# EAGLE design w65c265sxb_tms9118_dram (EAGLE 9.6.2)
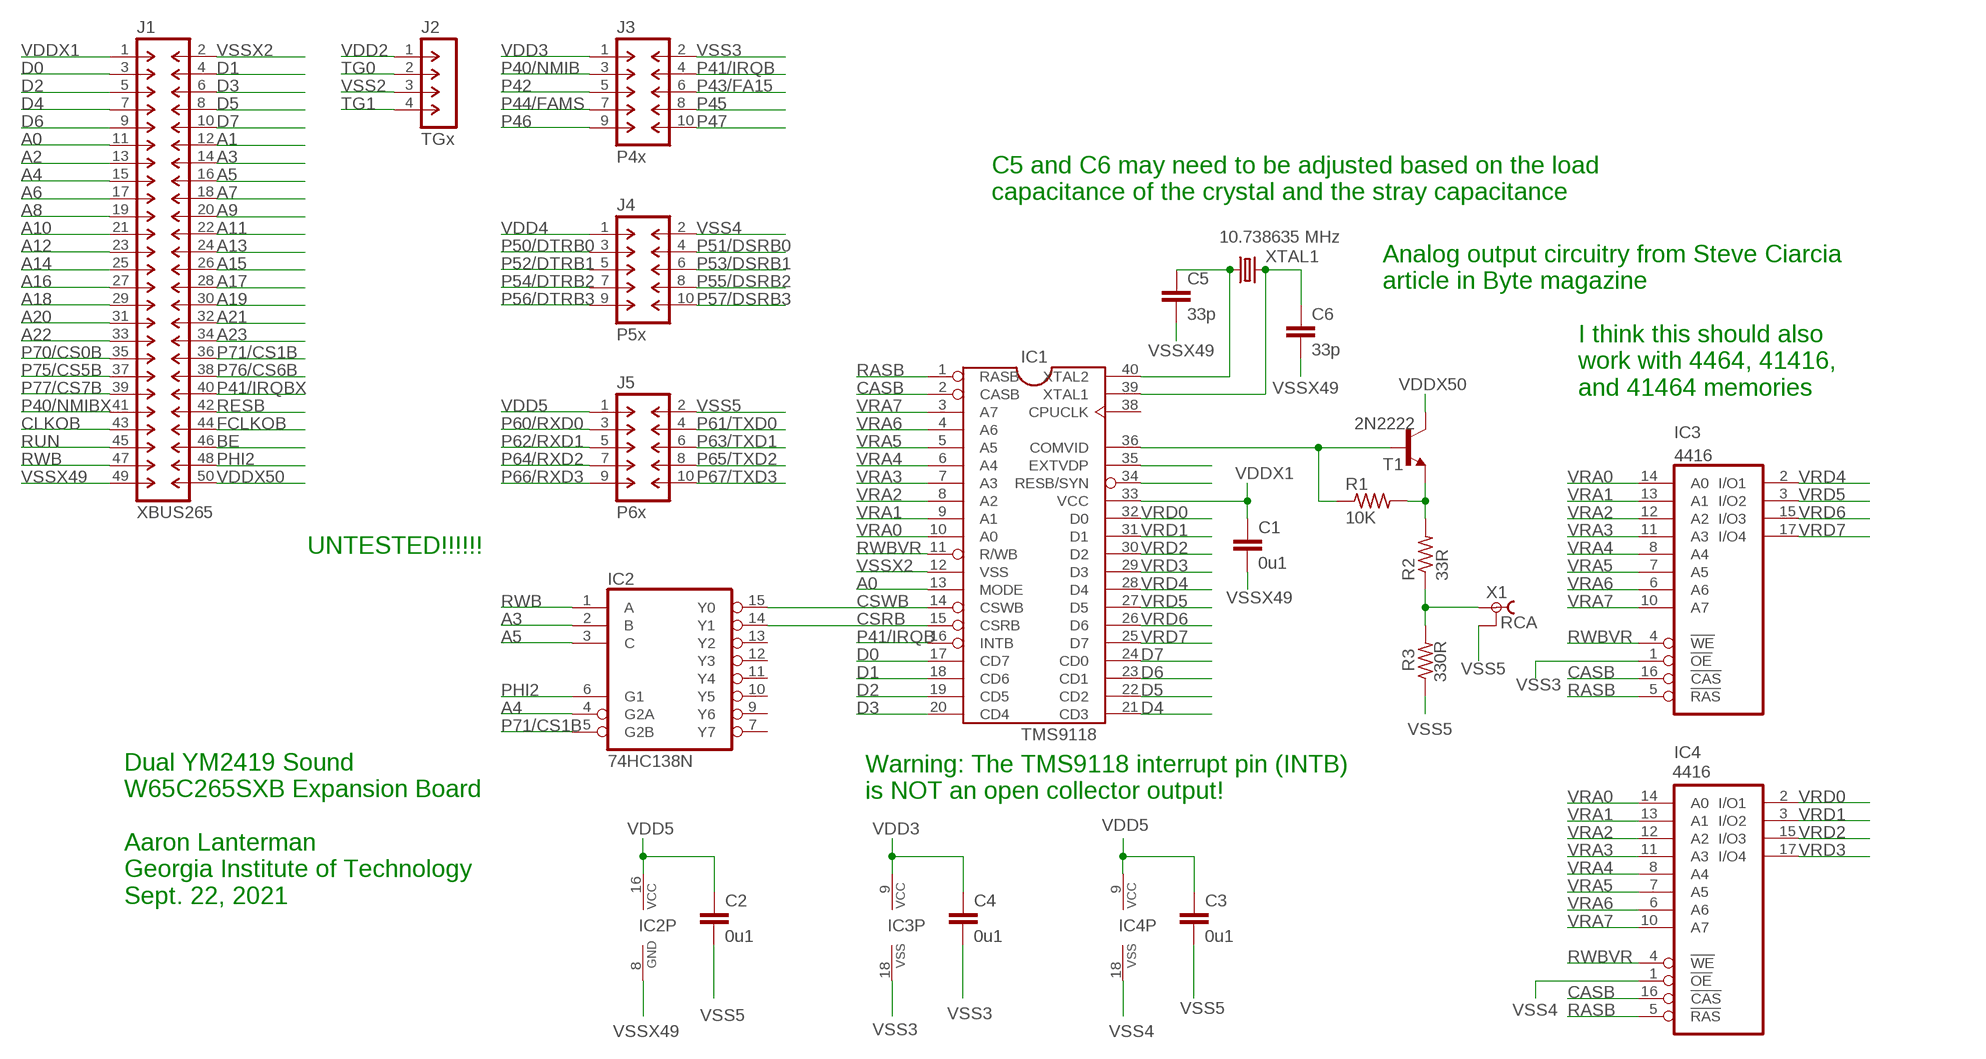
[diagram p0: schematic, sheet 1]

## Parts
C1  0u1  C-EU050-025X075-AARON  [C050-025X075-AARON]
C2  0u1  C-EU050-025X075-AARON  [C050-025X075-AARON]
C3  0u1  C-EU050-025X075-AARON  [C050-025X075-AARON]
C4  0u1  C-EU050-025X075-AARON  [C050-025X075-AARON]
C5  33p  C-EU050-025X075-AARON  [C050-025X075-AARON]
C6  33p  C-EU050-025X075-AARON  [C050-025X075-AARON]
IC1  TMS9118  [DIL40]
IC2  74HC138N  [DIL16]
IC3  41464  [DIL18]
IC4  41464  [DIL18]
J1  XBUS265  M-2X25-DIL-100  [DIL-100-2X25]
J2  TGx  M-1X04-SIP-100-40  [SIP-100-04-40]
J3  P4x  M-2X05-DIL-100  [DIL-100-2X05]
J4  P5x  M-2X05-DIL-100  [DIL-100-2X05]
J5  P6x  M-2X05-DIL-100  [DIL-100-2X05]
R1  10K  R-US_0207/10  [0207/10]
R2  33R  R-US_0207/10  [0207/10]
R3  330R  R-US_0207/10  [0207/10]
T1  2N2222  [TO92-EBC-OVAL]
X1  RCA  TOBU3  [TOBU3]
XTAL1  10.738635 MHz  CRYSTALHC49S  [HC49/S]

## Nets
A0: IC1.13(MODE) J1.11
A1: J1.12
A2: J1.13
A3: IC2.2(B) J1.14
A4: IC2.4(G2A) J1.15
A5: IC2.3(C) J1.16
A6: J1.17
A7: J1.18
A8: J1.19
A9: J1.20
A10: J1.21
A11: J1.22
A12: J1.23
A13: J1.24
A14: J1.25
A15: J1.26
A16: J1.27
A17: J1.28
A18: J1.29
A19: J1.30
A20: J1.31
A21: J1.32
A22: J1.33
A23: J1.34
BE: J1.46
CASB: IC1.2(CASB) IC3.16(!CAS) IC4.16(!CAS)
CLKOB: J1.43
CSRB: IC1.15(CSRB) IC2.14(Y1)
CSWB: IC1.14(CSWB) IC2.15(Y0)
D0: IC1.17(CD7) J1.3
D1: IC1.18(CD6) J1.4
D2: IC1.19(CD5) J1.5
D3: IC1.20(CD4) J1.6
D4: IC1.21(CD3) J1.7
D5: IC1.22(CD2) J1.8
D6: IC1.23(CD1) J1.9
D7: IC1.24(CD0) J1.10
FCLKOB: J1.44
N$7: R1.2 R2.2 T1.E
N$8: R2.1 R3.2 X1.1
N$20: IC1.36(COMVID) R1.1 T1.B
N$21: IC1.35(EXTVDP)
N$22: IC1.34(RESB/SYN)
P40/NMIB: J3.3
P40/NMIBX: J1.41
P41/IRQB: IC1.16(INTB) J3.4
P41/IRQBX: J1.40
P42: J3.5
P43/FA15: J3.6
P44/FAMS: J3.7
P45: J3.8
P46: J3.9
P47: J3.10
P50/DTRB0: J4.3
P51/DSRB0: J4.4
P52/DTRB1: J4.5
P53/DSRB1: J4.6
P54/DTRB2: J4.7
P55/DSRB2: J4.8
P56/DTRB3: J4.9
P57/DSRB3: J4.10
P60/RXD0: J5.3
P61/TXD0: J5.4
P62/RXD1: J5.5
P63/TXD1: J5.6
P64/RXD2: J5.7
P65/TXD2: J5.8
P66/RXD3: J5.9
P67/TXD3: J5.10
P70/CS0B: J1.35
P71/CS1B: IC2.5(G2B) J1.36
P75/CS5B: J1.37
P76/CS6B: J1.38
P77/CS7B: J1.39
PHI2: IC2.6(G1) J1.48
RASB: IC1.1(RASB) IC3.5(!RAS) IC4.5(!RAS)
RESB: J1.42
RUN: J1.45
RWB: IC2.1(A) J1.47
RWBVR: IC1.11(R/WB) IC3.4(!WE) IC4.4(!WE)
TG0: J2.2
TG1: J2.4
VDD2: J2.1
VDD3: C4.1 IC3.9(VCC) J3.1
VDD4: J4.1
VDD5: C2.1 C3.1 IC2.16(VCC) IC4.9(VCC) J5.1
VDDX1: C1.1 IC1.33(VCC) J1.1
VDDX50: J1.50 T1.C
VRA0: IC1.10(A0) IC3.14(A0) IC4.14(A0)
VRA1: IC1.9(A1) IC3.13(A1) IC4.13(A1)
VRA2: IC1.8(A2) IC3.12(A2) IC4.12(A2)
VRA3: IC1.7(A3) IC3.11(A3) IC4.11(A3)
VRA4: IC1.6(A4) IC3.8(A4) IC4.8(A4)
VRA5: IC1.5(A5) IC3.7(A5) IC4.7(A5)
VRA6: IC1.4(A6) IC3.6(A6) IC4.6(A6)
VRA7: IC1.3(A7) IC3.10(A7) IC4.10(A7)
VRD0: IC1.32(D0) IC4.2(I/O1)
VRD1: IC1.31(D1) IC4.3(I/O2)
VRD2: IC1.30(D2) IC4.15(I/O3)
VRD3: IC1.29(D3) IC4.17(I/O4)
VRD4: IC1.28(D4) IC3.2(I/O1)
VRD5: IC1.27(D5) IC3.3(I/O2)
VRD6: IC1.26(D6) IC3.15(I/O3)
VRD7: IC1.25(D7) IC3.17(I/O4)
VSS2: J2.3
VSS3: C4.2 IC3.1(!OE) IC3.18(VSS) J3.2
VSS4: IC4.1(!OE) IC4.18(VSS) J4.2
VSS5: C2.2 C3.2 J5.2 R3.1 X1.2 X1.2@1 X1.2@2
VSSX2: IC1.12(VSS) J1.2
VSSX49: C1.2 C5.2 C6.2 IC2.8(GND) J1.49
XTAL1: C6.1 IC1.39(XTAL1) XTAL1.2
XTAL2: C5.1 IC1.40(XTAL2) XTAL1.1
Unconnected: IC1.38(CPUCLK) IC2.7(Y7) IC2.9(Y6) IC2.10(Y5) IC2.11(Y4) IC2.12(Y3) IC2.13(Y2)

## Notes on the sheet
- C5 and C6 may need to be adjusted based on the load
  capacitance of the crystal and the stray capacitance
- Analog output circuitry from Steve Ciarcia
  article in Byte magazine
- I think this should also
  work with 4464, 41416,
  and 41464 memories
- 4416
- UNTESTED!!!!!!
- 4416
- Warning: The TMS9118 interrupt pin (INTB)
  is NOT an open collector output!
- Dual YM2419 Sound
  W65C265SXB Expansion Board
  
  Aaron Lanterman
  Georgia Institute of Technology
  Sept. 22, 2021

## Library data of the parts
C1-C6 = aaroncaps:C-EU: CAPACITOR, European symbol
IC1 = 1987computer:TMS9118: Video Display Controller
IC2 = 74xx-eu:74*138: 3-line to 8-line DECODER/DEMULTIPLEXER
IC3 IC4 = memories:41464: DRAM 64K x 4 bits
J1 = con-headers-jp:M-2X25-: MALE HEADER
J2 = con-headers-jp:M-1X04-: MALE HEADER
J3-J5 = con-headers-jp:M-2X05-: MALE HEADER
R1-R3 = rcl:R-US_: RESISTOR, American symbol; SPICEPREFIX: R
T1 = adafruit:2N2222: NPN TRANSISTOR Big oval pads
X1 = con-hirschmann:TOBU3: Female Cinch CONNECTOR ( RCA Jack ); MF: FARNELL; MPN: TOBU 3; OC_FARNELL: 592791; OC_NEWARK: 06WX5914
XTAL1 = crystal:CRYSTAL: CRYSTAL; OC_FARNELL: 1667008; OC_NEWARK: unknown

## Board
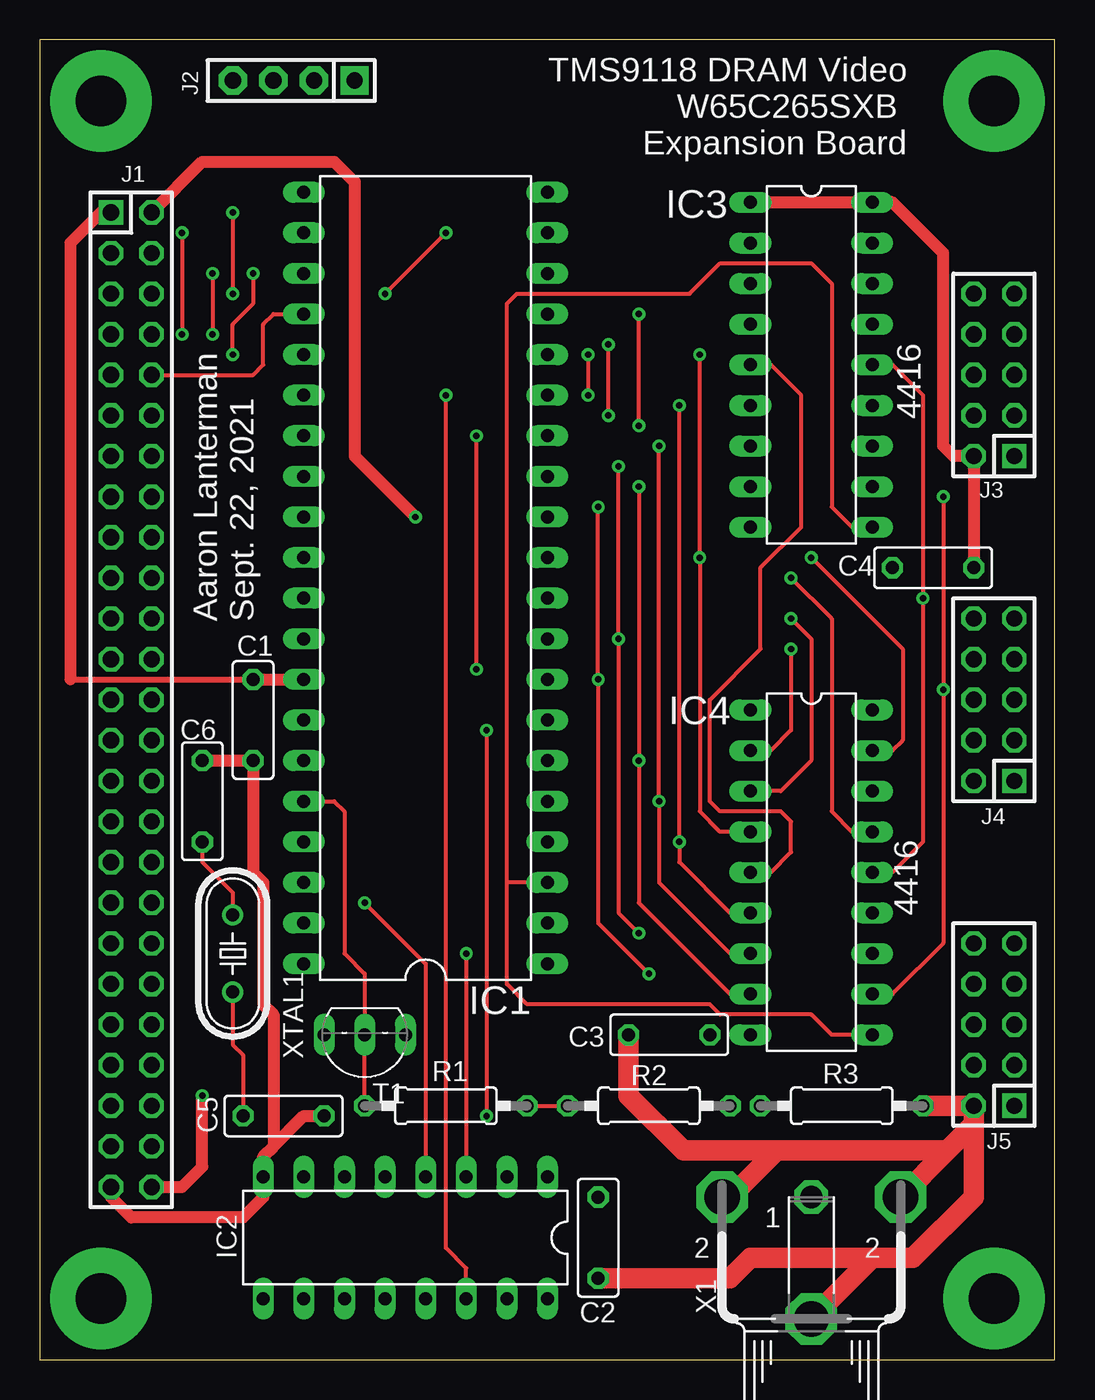
[diagram p1: board, top side]
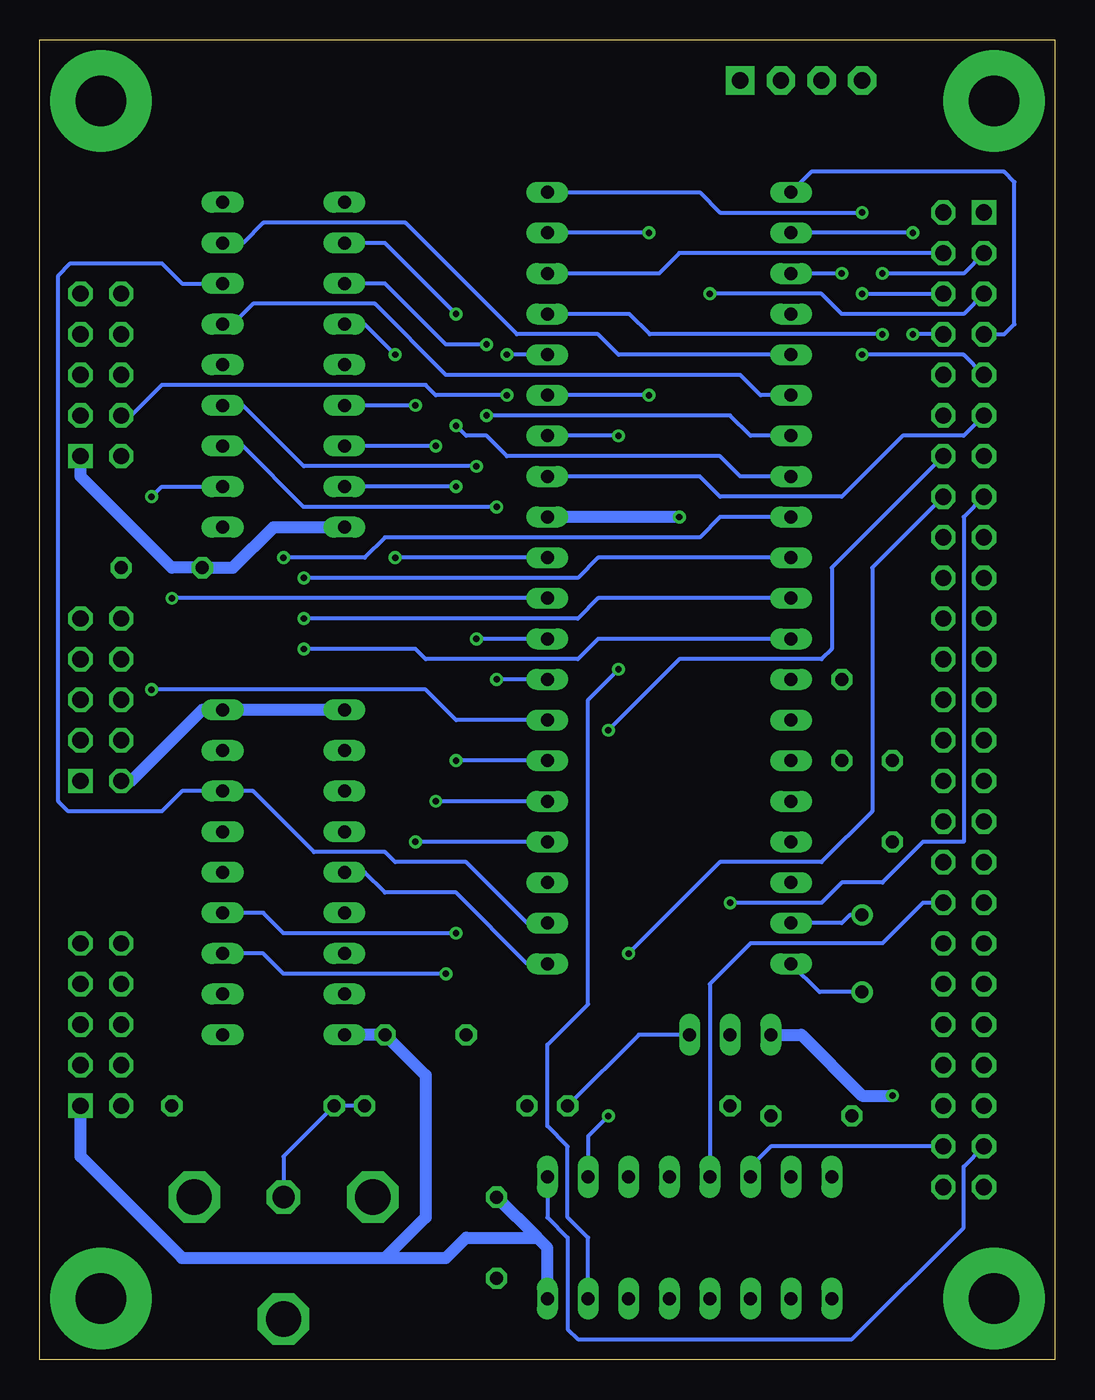
[diagram p2: board, bottom side, seen from below]

Size 63.5 x 82.55 mm. Coordinates in mm from the lower left corner, seen from the top.
Outline: 0,0 63.5,0 63.5,82.55 0,82.55 0,0
Copper layers (1*16): Top 0.035mm / dielectric 1.5mm / Bottom 0.035mm
Design rules "InventionStudioDesignRules": minimum track width 10mil, minimum drill 0.4mm, track to track 10mil, track to pad 10mil, pad to pad 10mil, via to via 10mil, smd to smd 10mil, copper to edge 40mil, drill to drill 6mil, minimum pad ring 10mil, minimum via ring 8mil, stop-mask expansion 4mil, vias tented up to drill 0mil, thermal gap 10mil

### Footprints (pad centres in the part's own frame; a part is rotated, then mirrored left to right if it is on the bottom)
C050-025X075-AARON = drill 0.813 octagon: 1 -2.54,0; 2 2.54,0
DIL40 = drill 0.813 long: 1 -24.13,-7.62; 2 -21.59,-7.62; 3 -19.05,-7.62; 4 -16.51,-7.62; 5 -13.97,-7.62; 6 -11.43,-7.62; 7 -8.89,-7.62; 8 -6.35,-7.62; 9 -3.81,-7.62; 10 -1.27,-7.62; 11 1.27,-7.62; 12 3.81,-7.62; 13 6.35,-7.62; 14 8.89,-7.62; 15 11.43,-7.62; 16 13.97,-7.62; 17 16.51,-7.62; 18 19.05,-7.62; 19 21.59,-7.62; 20 24.13,-7.62; 21 24.13,7.62; 22 21.59,7.62; 23 19.05,7.62; 24 16.51,7.62; 25 13.97,7.62; 26 11.43,7.62; 27 8.89,7.62; 28 6.35,7.62; 29 3.81,7.62; 30 1.27,7.62; 31 -1.27,7.62; 32 -3.81,7.62; 33 -6.35,7.62; 34 -8.89,7.62; 35 -11.43,7.62; 36 -13.97,7.62; 37 -16.51,7.62; 38 -19.05,7.62; 39 -21.59,7.62; 40 -24.13,7.62
DIL16 = drill 0.813 long: 1 -8.89,-3.81; 2 -6.35,-3.81; 3 -3.81,-3.81; 4 -1.27,-3.81; 5 1.27,-3.81; 6 3.81,-3.81; 7 6.35,-3.81; 8 8.89,-3.81; 9 8.89,3.81; 10 6.35,3.81; 11 3.81,3.81; 12 1.27,3.81; 13 -1.27,3.81; 14 -3.81,3.81; 15 -6.35,3.81; 16 -8.89,3.81
DIL18 = drill 0.813 long: 1 -10.16,-3.81; 2 -7.62,-3.81; 3 -5.08,-3.81; 4 -2.54,-3.81; 5 0,-3.81; 6 2.54,-3.81; 7 5.08,-3.81; 8 7.62,-3.81; 9 10.16,-3.81; 10 10.16,3.81; 11 7.62,3.81; 12 5.08,3.81; 13 2.54,3.81; 14 0,3.81; 15 -2.54,3.81; 16 -5.08,3.81; 17 -7.62,3.81; 18 -10.16,3.81
DIL-100-2X25 = drill 1.016 square: 1 -30.48,-1.27 | drill 1.016 octagon: 2 -30.48,1.27; 3 -27.94,-1.27; 4 -27.94,1.27; 5 -25.4,-1.27; 6 -25.4,1.27; 7 -22.86,-1.27; 8 -22.86,1.27; 9 -20.32,-1.27; 10 -20.32,1.27; 11 -17.78,-1.27; 12 -17.78,1.27; 13 -15.24,-1.27; 14 -15.24,1.27; 15 -12.7,-1.27; 16 -12.7,1.27; 17 -10.16,-1.27; 18 -10.16,1.27; 19 -7.62,-1.27; 20 -7.62,1.27; 21 -5.08,-1.27; 22 -5.08,1.27; 23 -2.54,-1.27; 24 -2.54,1.27; 25 0,-1.27; 26 0,1.27; 27 2.54,-1.27; 28 2.54,1.27; 29 5.08,-1.27; 30 5.08,1.27; 31 7.62,-1.27; 32 7.62,1.27; 33 10.16,-1.27; 34 10.16,1.27; 35 12.7,-1.27; 36 12.7,1.27; 37 15.24,-1.27; 38 15.24,1.27; 39 17.78,-1.27; 40 17.78,1.27; 41 20.32,-1.27; 42 20.32,1.27; 43 22.86,-1.27; 44 22.86,1.27; 45 25.4,-1.27; 46 25.4,1.27; 47 27.94,-1.27; 48 27.94,1.27; 49 30.48,-1.27; 50 30.48,1.27
SIP-100-04-40 = drill 1.016 pad 1.778 square: 1 -3.81,0 | drill 1.016 pad 1.778 octagon: 2 -1.27,0; 3 1.27,0; 4 3.81,0
DIL-100-2X05 = drill 1.016 square: 1 -5.08,-1.27 | drill 1.016 octagon: 2 -5.08,1.27; 3 -2.54,-1.27; 4 -2.54,1.27; 5 0,-1.27; 6 0,1.27; 7 2.54,-1.27; 8 2.54,1.27; 9 5.08,-1.27; 10 5.08,1.27
0207/10 = drill 0.813 octagon: 1 -5.08,0; 2 5.08,0
TO92-EBC-OVAL = drill 0.813 long: B 0,-1.27; C 2.54,-1.27; E -2.54,-1.27
TOBU3 = drill 1.397 octagon: 1 0,-2.54 | drill 2.21 octagon: 2 5.588,-2.54; 2@1 -5.588,-2.54; 2@2 0,5.08
HC49/S = drill 0.813: 1 -2.413,0; 2 2.413,0

### Placement (x,y rotation side)
C1  13.34,40.01 270 top
C2  34.92,7.62 270 top
C3  39.37,20.32 180 top
C4  55.88,49.53 0 top
C5  15.24,15.24 0 top
C6  10.16,34.92 90 top
IC1  24.13,48.9 90 top
IC2  22.86,7.62 180 top
IC3  48.26,62.23 270 top
IC4  48.26,30.48 270 top
J1  5.71,41.27 270 top
J2  15.88,80.01 180 top
J3  59.69,61.59 90 top
J4  59.69,41.27 90 top
J5  59.69,20.95 90 top
R1  25.4,15.88 0 top
R2  38.1,15.88 180 top
R3  50.16,15.88 180 top
T1  20.32,19.05 180 top
X1  48.26,7.62 180 top
XTAL1  12.06,25.4 90 top

### Tracks (layer width: path | path; a pad name or v marks a point on that pad's centre or on a via)
A0
  Bottom 0.254: J1.11 5.71,57.78 9.53,57.78 13.34,53.98 20.95,53.98 22.23,55.24 IC1.13
A3  (via drill 0.4)
  Top 0.254: v27.94,39.37 v27.94,15.24
  Bottom 0.254: J1.14 13.97,49.53 13.97,44.45 14.61,43.81 23.5,43.81 v27.94,39.37 | v27.94,15.24 29.21,13.97 IC2.2
A4  (via drill 0.4)
  Top 0.254: v20.32,28.57 24.13,24.77 IC2.4
  Bottom 0.254: J1.15 5.71,52.7 5.71,32.38 8.26,32.38 10.79,29.84 13.34,29.84 13.97,29.21 14.61,28.57 v20.32,28.57
A5  (via drill 0.4)
  Top 0.254: v26.67,25.4 IC2.3
  Bottom 0.254: J1.16 11.43,49.53 11.43,34.29 14.61,31.11 20.95,31.11 v26.67,25.4
CASB
  Bottom 0.254: IC1.2 33.02,27.3 36.83,31.11 41.27,31.11 41.91,31.75 46.35,31.75 50.16,35.56 IC4.16 54.61,35.56 55.88,34.29 61.72,34.29 62.36,34.92 62.36,67.82 61.59,68.58 55.88,68.58 54.61,67.31 IC3.16
CSRB  (via drill 0.4)
  Top 0.254: IC2.14 26.67,5.71 25.4,6.99 v25.4,60.33
  Bottom 0.254: v25.4,60.33 IC1.15
CSWB  (via drill 0.4)
  Top 0.254: v27.3,43.18 v27.3,57.78
  Bottom 0.254: IC2.15 29.21,7.62 30.48,8.89 30.48,13.34 31.75,14.61 31.75,19.68 29.21,22.23 29.21,41.27 v27.3,43.18 | v27.3,57.78 IC1.14
D0  (via drill 0.4)
  Top 0.254: v10.79,67.94 v10.79,64.14
  Bottom 0.254: J1.3 5.71,67.94 v10.79,67.94 | v10.79,64.14 25.35,64.14 26.62,65.41 IC1.17
D1
  Bottom 0.254: J1.4 23.5,69.22 24.77,67.94 IC1.18
D2  (via drill 0.4)
  Top 0.254: v25.4,70.48 v21.59,66.67
  Bottom 0.254: J1.5 5.71,65.41 13.34,65.41 14.61,66.67 v21.59,66.67 | v25.4,70.48 IC1.19
D3  (via drill 0.4)
  Top 0.254: v12.06,71.75 v12.06,66.67
  Bottom 0.254: IC1.20 22.23,73.03 20.95,71.75 v12.06,71.75 | v12.06,66.67 J1.6
D4
  Bottom 0.254: J1.7 3.17,64.14 2.54,64.77 2.54,73.66 3.17,74.3 15.24,74.3 IC1.21
D5  (via drill 0.4)
  Top 0.254: v8.89,70.48 v8.89,64.14
  Bottom 0.254: J1.8 v8.89,64.14 | v8.89,70.48 IC1.22
D6  (via drill 0.4)
  Top 0.254: v13.34,67.94 13.34,66.04 12.38,65.09 12.06,64.77 v12.06,62.87
  Bottom 0.254: J1.9 5.71,62.87 v12.06,62.87 | v13.34,67.94 IC1.23
D7
  Top 0.254: J1.10 13.34,61.59 13.97,62.23 13.97,64.77 14.61,65.41 IC1.24
N$1  (via drill 3.17 pad 6.35)
  other vias: 3.81,3.81
N$2  (via drill 3.17 pad 6.35)
  other vias: 59.69,3.81
N$3  (via drill 3.17 pad 6.35)
  other vias: 59.69,78.74
N$4  (via drill 3.17 pad 6.35)
  other vias: 3.81,78.74
N$7
  Top 0.254: R1.2 R2.2
  Bottom 0.254: T1.E 26.04,20.32 R1.2
N$8
  Bottom 0.254: R2.1 R3.2 48.26,12.7 X1.1
N$20
  Top 0.254: IC1.36 18.41,34.92 19.05,34.29 19.05,25.4 20.32,24.13 T1.B R1.1
P41/IRQB  (via drill 0.4)
  Top 0.254: v34.29,62.87 v34.29,60.33
  Bottom 0.254: IC1.16 v34.29,62.87 | v34.29,60.33 38.73,60.33 39.37,60.96 55.88,60.96 57.78,59.05 J3.4
P71/CS1B
  Bottom 0.254: J1.36 8.26,28.57 10.79,26.04 19.05,26.04 21.59,23.5 IC2.5
PHI2
  Bottom 0.254: J1.48 17.78,13.34 19.05,12.06 IC2.6
RASB
  Top 0.254: IC4.5 45.72,30.48 46.99,31.75 46.99,33.66 46.35,34.29 42.55,34.29 41.91,34.92 41.91,41.27 45.09,44.45 45.09,49.53 47.62,52.07 47.62,60.33 45.72,62.23 IC3.5
  Bottom 0.254: IC1.1 33.02,24.77 37.47,29.21 41.91,29.21 43.18,30.48 IC4.5
RWB
  Bottom 0.254: IC2.1 31.75,8.89 30.48,7.62 30.48,1.91 29.84,1.27 12.7,1.27 5.71,8.26 5.71,12.06 J1.47
RWBVR  (via drill 0.4)
  Top 0.254: v41.27,62.87 v41.27,50.16 41.27,34.29 42.55,33.02 IC4.4
  Bottom 0.254: IC1.11 v41.27,50.16 | v41.27,62.87 43.18,64.77 IC3.4
VDD3
  Bottom 0.762: IC3.9 48.9,52.07 51.44,49.53 C4.1 55.24,49.53 60.96,55.24 J3.1
VDD5
  Bottom 0.762: IC2.16 31.75,6.99 32.38,7.62 | 32.38,7.62 C2.1 | 41.91,6.35 54.61,6.35 60.96,12.7 J5.1 | 41.91,6.35 39.37,8.89 39.37,17.78 C3.1 IC4.9 | 32.38,7.62 36.83,7.62 38.1,6.35 41.91,6.35
VDDX1
  Top 0.381: 1.91,42.55 C1.1
  Top 0.762: C1.1 IC1.33 | J1.1 3.81,71.75 1.91,69.85 1.91,42.55
VDDX50  (via drill 0.4)
  Top 0.762: J1.50 8.89,10.79 10.16,12.06 v10.16,16.51
  Bottom 0.762: T1.C 15.88,20.32 12.06,16.51 v10.16,16.51
VRA0  (via drill 0.4)
  Top 0.254: IC3.14 53.34,62.23 55.24,60.33 v55.24,47.62 55.24,32.38 53.34,30.48 IC4.14
  Bottom 0.254: IC1.10 v55.24,47.62
VRA1  (via drill 0.4)
  Top 0.254: v37.47,26.67 36.2,27.94 v36.2,45.09 v36.2,55.88
  Bottom 0.254: v37.47,26.67 48.26,26.67 49.53,27.94 IC4.13 | v36.2,55.88 46.99,55.88 50.8,59.69 IC3.13 | IC1.9 v36.2,45.09
VRA2  (via drill 0.4)
  Top 0.254: v34.92,53.34 v34.92,42.55 34.92,27.3 v38.1,24.13
  Bottom 0.254: v34.92,53.34 46.99,53.34 50.8,57.15 IC3.12 | v38.1,24.13 48.26,24.13 49.53,25.4 IC4.12 | IC1.8 v34.92,42.55
VRA3  (via drill 0.4)
  Top 0.254: v56.52,53.98 v56.52,41.91 56.52,26.04 53.34,22.86 IC4.11
  Bottom 0.254: v56.52,41.91 39.37,41.91 37.47,40.01 IC1.7 | v56.52,53.98 55.88,54.61 IC3.11
VRA4  (via drill 0.4)
  Top 0.254: v37.47,54.61 v37.47,37.47 37.47,28.57 43.18,22.86 IC4.8
  Bottom 0.254: v37.47,54.61 IC3.8 | IC1.6 v37.47,37.47
VRA5  (via drill 0.4)
  Top 0.254: IC4.7 43.18,25.4 38.73,29.84 v38.73,34.92 v38.73,57.15
  Bottom 0.254: v38.73,57.15 IC3.7 | IC1.5 v38.73,34.92
VRA6  (via drill 0.4)
  Top 0.254: IC4.6 43.18,27.94 40.01,31.11 v40.01,32.38 v40.01,59.69
  Bottom 0.254: v40.01,59.69 IC3.6 | IC1.4 v40.01,32.38
VRA7
  Top 0.254: 29.21,29.84 29.21,23.5 30.48,22.23 41.91,22.23 42.55,21.59 48.26,21.59 49.53,20.32 IC4.10 | IC1.3 29.21,29.84 | 29.21,29.84 29.21,66.04 29.84,66.67 40.64,66.67 42.55,68.58 48.26,68.58 49.53,67.31 49.53,53.34 50.8,52.07 IC3.10
VRD0  (via drill 0.4)
  Top 0.254: v46.99,44.45 46.99,39.37 45.72,38.1 IC4.2
  Bottom 0.254: IC1.32 28.57,45.09 29.84,43.81 39.37,43.81 40.01,44.45 v46.99,44.45
VRD1  (via drill 0.4)
  Top 0.254: v46.99,46.35 48.26,45.09 48.26,37.47 46.35,35.56 IC4.3
  Bottom 0.254: IC1.31 28.57,47.62 29.84,46.35 v46.99,46.35
VRD2  (via drill 0.4)
  Top 0.254: v46.99,48.9 49.53,46.35 49.53,34.29 50.8,33.02 IC4.15
  Bottom 0.254: IC1.30 28.57,50.16 29.84,48.9 v46.99,48.9
VRD3  (via drill 0.4)
  Top 0.254: v48.26,50.16 53.98,44.45 53.98,38.73 53.34,38.1 IC4.17
  Bottom 0.254: IC1.29 20.95,52.7 22.23,51.44 41.91,51.44 43.18,50.16 v48.26,50.16
VRD4  (via drill 0.4)
  Top 0.254: v37.47,58.42 v37.47,65.41
  Bottom 0.254: IC1.28 19.68,55.24 20.95,56.52 34.29,56.52 35.56,57.78 36.83,57.78 v37.47,58.42 | v37.47,65.41 41.91,69.85 IC3.2
VRD5  (via drill 0.4)
  Top 0.254: v35.56,59.05 v35.56,63.5
  Bottom 0.254: IC1.27 19.05,57.78 20.32,59.05 v35.56,59.05 | v35.56,63.5 38.1,63.5 41.91,67.31 IC3.3
VRD6
  Bottom 0.254: IC1.26 18.41,60.33 19.68,61.59 38.1,61.59 42.55,66.04 50.16,66.04 51.44,64.77 IC3.15
VRD7
  Bottom 0.254: IC1.25 27.3,62.87 28.57,64.14 33.66,64.14 40.64,71.12 49.53,71.12 50.8,69.85 IC3.17
VSS3
  Top 0.762: IC3.1 IC3.18 53.34,72.39 56.52,69.22 56.52,57.15 57.15,56.52 J3.2 C4.2
VSS4
  Bottom 0.762: IC4.1 IC4.18 53.34,40.64 57.78,36.2 J4.2
VSS5
  Top 0.762: X1.2 43.18,10.16
  Top 1.27: 58.42,14.73 J5.2 R3.1 | 58.42,14.73 56.77,13.08 | 56.77,13.08 X1.2@1 | X1.2@2 52.07,6.35 | 52.07,6.35 54.61,6.35 58.42,10.16 58.42,14.73 | 46.1,13.08 56.77,13.08 | 43.18,10.16 46.1,13.08 | C2.2 43.18,5.08 44.45,6.35 52.07,6.35 | C3.2 36.83,16.51 40.26,13.08 46.1,13.08
VSSX2  (via drill 0.4)
  Top 0.762: J1.2 10.16,74.93 18.41,74.93 19.68,73.66 19.68,56.52 v23.5,52.7
  Bottom 0.762: v23.5,52.7 IC1.12
VSSX49
  Top 0.762: J1.49 4.45,10.16 5.71,8.89 12.7,8.89 13.97,10.16 IC2.8 13.97,12.7 14.61,13.34 | 14.61,13.34 16.51,15.24 C5.2 | 14.61,13.34 14.61,21.59 13.97,22.23 13.97,29.84 13.34,30.48 C1.2 C6.2
XTAL1
  Top 0.254: C6.1 10.16,31.11 12.06,29.21 XTAL1.2
  Bottom 0.254: XTAL1.2 12.83,27.81 13.34,27.3 IC1.39
XTAL2
  Top 0.254: XTAL1.1 12.06,19.68 12.7,19.05 C5.1
  Bottom 0.254: XTAL1.1 14.73,22.99 IC1.40

### Text on the board
tNames: TMS9118 DRAM Video / W65C265SXB / Expansion Board | 4416 | Aaron Lanterman / Sept. 22, 2021 | 4416